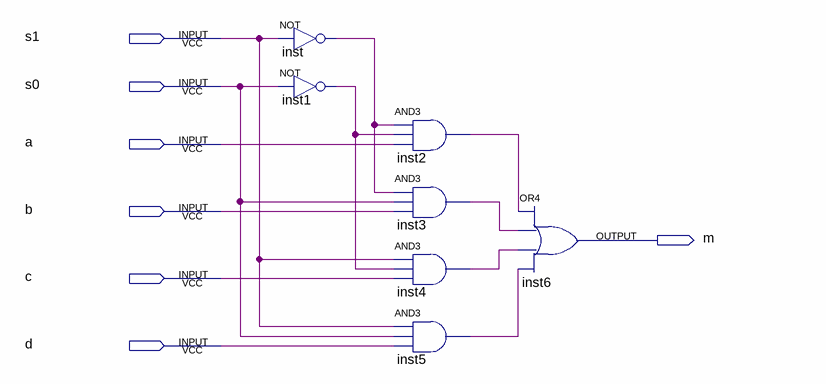
[diagram p0: schematic sheet]
// Quartus schematic MUX411BIT.bdf as structural Verilog: 7 symbols, 7 pins
module MUX411BIT (
  input  s1,
  input  s0,
  input  a,
  input  b,
  input  c,
  input  d,
  output m
);

  wire inst1_out, inst2_out, inst3_out, inst4_out, inst5_out, inst_out;

  not inst (inst_out, s1);
  not inst1 (inst1_out, s0);
  and inst2 (inst2_out, inst_out, inst1_out, a);
  and inst3 (inst3_out, inst_out, s0, b);
  and inst4 (inst4_out, s1, inst1_out, c);
  and inst5 (inst5_out, s1, s0, d);
  or inst6 (m, inst2_out, inst3_out, inst4_out, inst5_out);
endmodule
